# EAGLE design breakout (EAGLE 7.5.0)
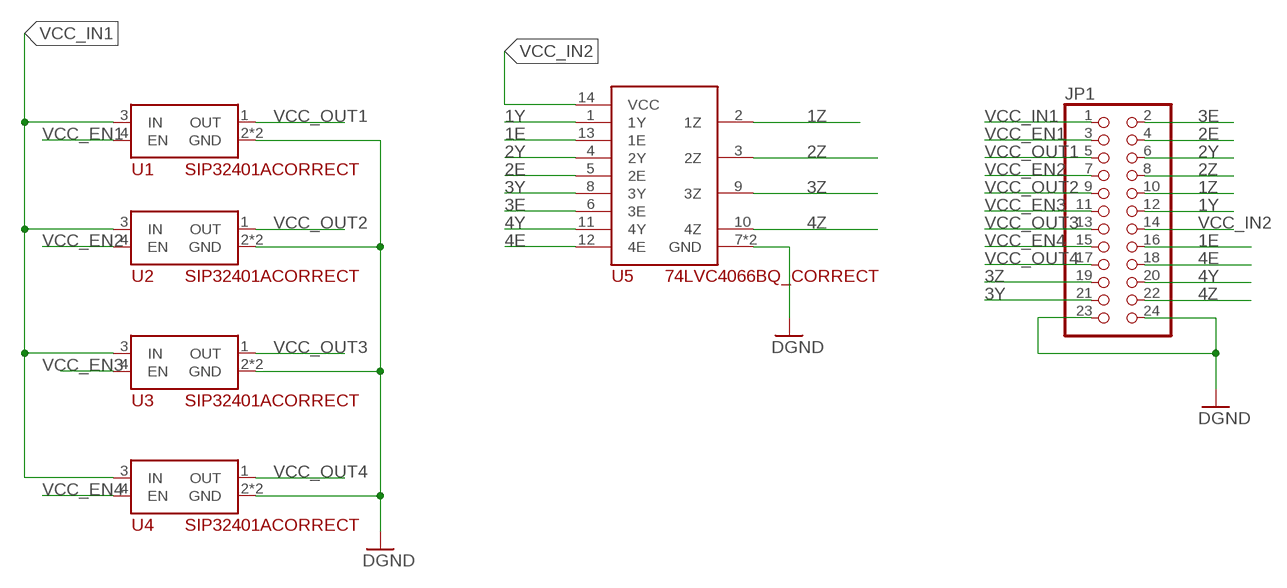
[diagram p0: schematic, sheet 1]

## Parts
JP1  PINHD-2X12/90  [2X12/90]
U1  SIP32401ACORRECT  [TDFN4_CORRECT]
U2  SIP32401ACORRECT  [TDFN4_CORRECT]
U3  SIP32401ACORRECT  [TDFN4_CORRECT]
U4  SIP32401ACORRECT  [TDFN4_CORRECT]
U5  74LVC4066BQ_CORRECT  [DHVQFN14_CORRECTED]

## Nets
1E: JP1.16 U5.13(1E)
1Y: JP1.12 U5.1(1Y)
1Z: JP1.10 U5.2(1Z)
2E: JP1.4 U5.5(2E)
2Y: JP1.6 U5.4(2Y)
2Z: JP1.8 U5.3(2Z)
3E: JP1.2 U5.6(3E)
3Y: JP1.21 U5.8(3Y)
3Z: JP1.19 U5.9(3Z)
4E: JP1.18 U5.12(4E)
4Y: JP1.20 U5.11(4Y)
4Z: JP1.22 U5.10(4Z)
GND: JP1.23 JP1.24 U1.2(GND) U1.PADDLE(GND) U2.2(GND) U2.PADDLE(GND) U3.2(GND) U3.PADDLE(GND) U4.2(GND) U4.PADDLE(GND) U5.7(GND) U5.PADDLE(GND) ; supply symbol labelled DGND
VCC_EN1: JP1.3 U1.4(EN)
VCC_EN2: JP1.7 U2.4(EN)
VCC_EN3: JP1.11 U3.4(EN)
VCC_EN4: JP1.15 U4.4(EN)
VCC_IN1: JP1.1 U1.3(IN) U2.3(IN) U3.3(IN) U4.3(IN)
VCC_IN2: JP1.14 U5.14(VCC)
VCC_OUT1: JP1.5 U1.1(OUT)
VCC_OUT2: JP1.9 U2.1(OUT)
VCC_OUT3: JP1.13 U3.1(OUT)
VCC_OUT4: JP1.17 U4.1(OUT)

## Library data of the parts
JP1 = pinhead:PINHD-2X12: PIN HEADER
U1-U4 = imix:SIP32401A: SIP32401A slew rate controlled load switch from Vishay.
U5 = imix:74LVC4066: 74LVC4066 bidirectional quad analog switch.; DATASHEET: http://www.digikey.com/product-detail/en/nexperia-usa-inc/74LVC4066BQ,115/568-3019-1-ND/1023424; MANUFACTURER: Nexperia USA Inc.; MPN: 74LVC4066BQ; VENDOR: Digikey; VPN: 568-3019-1-ND

## Board
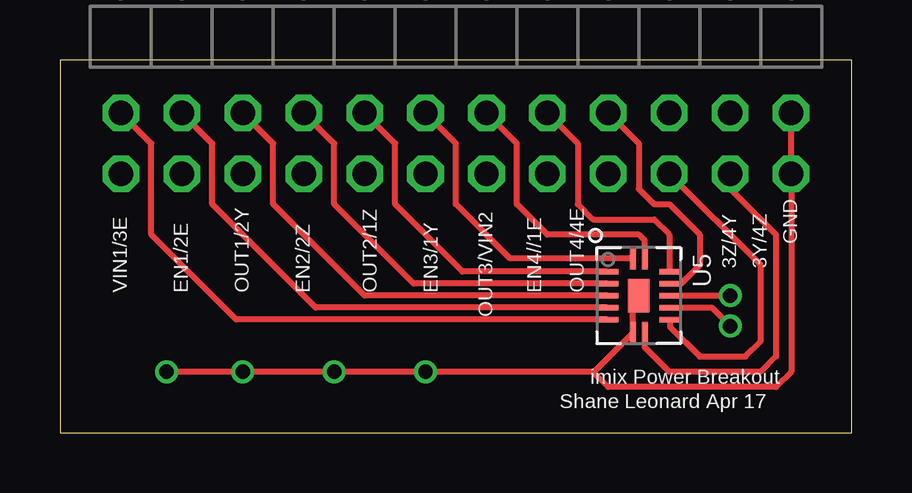
[diagram p1: board, top side]
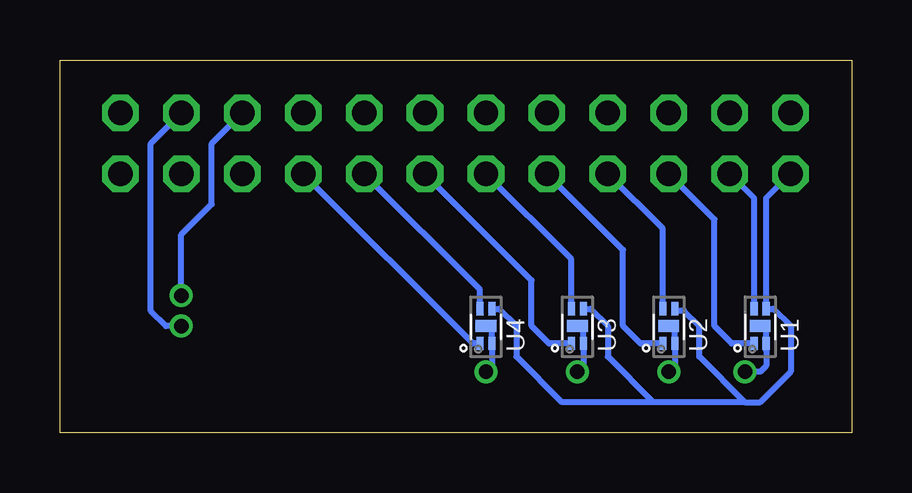
[diagram p2: board, bottom side, seen from below]

Size 33 x 15.54 mm. Coordinates in mm from the lower left corner, seen from the top.
Outline: 0,0 33,0 33,15.54 0,15.54 0,0
Copper layers (1*16): Top 0.0356mm / dielectric 1.5011mm / Bottom 0.0356mm
Design rules "oshpark-2layer": minimum track width 6mil, minimum drill 13mil, track to track 6mil, track to pad 6mil, pad to pad 6mil, via to via 6mil, smd to smd 6mil, copper to edge 15mil, drill to drill 6mil, minimum pad ring 7mil, minimum via ring 7mil, stop-mask expansion 2.5mil, vias tented up to drill 0mil, thermal gap 10mil

### Footprints (pad centres in the part's own frame; a part is rotated, then mirrored left to right if it is on the bottom)
2X12/90 = drill 1.016 octagon: 1 -13.97,-6.35; 2 -13.97,-3.81; 3 -11.43,-6.35; 4 -11.43,-3.81; 5 -8.89,-6.35; 6 -8.89,-3.81; 7 -6.35,-6.35; 8 -6.35,-3.81; 9 -3.81,-6.35; 10 -3.81,-3.81; 11 -1.27,-6.35; 12 -1.27,-3.81; 13 1.27,-6.35; 14 1.27,-3.81; 15 3.81,-6.35; 16 3.81,-3.81; 17 6.35,-6.35; 18 6.35,-3.81; 19 8.89,-6.35; 20 8.89,-3.81; 21 11.43,-6.35; 22 11.43,-3.81; 23 13.97,-6.35; 24 13.97,-3.81
TDFN4_CORRECT = smd 0.3 x 0.55: 1 0.25,0.725; 2 -0.25,0.725; 3 -0.25,-0.725; 4 0.25,-0.725 | smd 0.86 x 0.5: PADDLE 0,0
DHVQFN14_CORRECTED = smd 0.9 x 0.24: 1 -1.55,-0.25; 7 1.55,-0.25; 8 1.55,0.25; 14 -1.55,0.25 | smd 0.24 x 0.9: 2 -1,-1.3; 3 -0.5,-1.3; 4 0,-1.3; 5 0.5,-1.3; 6 1,-1.3; 9 1,1.3; 10 0.5,1.3; 11 0,1.3; 12 -0.5,1.3; 13 -1,1.3 | smd 1.4 x 0.9: PADDLE 0,0

### Placement (x,y rotation side)
JP1  16.51,17.14 0 top
U1  3.81,4.45 180 bottom
U2  7.62,4.45 180 bottom
U3  11.43,4.45 180 bottom
U4  15.24,4.45 180 bottom
U5  24.13,5.71 270 top

### Tracks (layer width: path | path; a pad name or v marks a point on that pad's centre or on a via)
1E
  Top 0.254: JP1.16 21.59,12.06 21.59,9.53 22.23,8.89 24.77,8.89 25.4,8.26 25.4,6.75 U5.13
1Y
  Top 0.254: U5.1 18.77,7.26 16.51,9.53 16.51,12.06 JP1.12
1Z
  Top 0.254: U5.2 16.78,6.71 13.97,9.53 13.97,12.06 JP1.10
2E
  Top 0.254: U5.5 10.66,5.21 6.35,9.53 6.35,12.06 JP1.4
2Y
  Top 0.254: U5.4 12.7,5.71 8.89,9.53 8.89,12.06 JP1.6
2Z
  Top 0.254: U5.3 14.74,6.21 11.43,9.53 11.43,12.06 JP1.8
3E
  Top 0.254: U5.6 7.35,4.71 3.81,8.26 3.81,12.06 JP1.2
3Y
  Top 0.254: JP1.21 27.94,10.16 29.84,8.26 29.84,3.17 29.21,2.54 25.4,2.54 24.38,3.56 U5.8
3Z
  Top 0.254: U5.9 25.43,4.42 26.67,3.17 28.57,3.17 29.21,3.81 29.21,6.99 JP1.19
4E
  Top 0.254: JP1.18 24.13,12.06 24.13,10.16 24.77,9.53 25.4,9.53 26.67,8.26 26.67,6.99 25.9,6.21 U5.12
4Y  (via drill 0.6)
  Top 0.254: U5.11 v27.94,5.71
  Bottom 0.254: v27.94,5.71 27.94,8.26 26.67,9.53 26.67,12.06 JP1.20
4Z  (via drill 0.6)
  Top 0.254: U5.10 27.17,5.21 v27.94,4.45
  Bottom 0.254: v27.94,4.45 28.57,4.45 29.21,5.08 29.21,12.06 JP1.22
GND  (via drill 0.6)
  Top 0.254: 22.23,2.54 22.25,2.54 U5.7 23.88,5.71 U5.PADDLE | 22.23,2.54 v15.24,2.54 v11.43,2.54 v7.62,2.54 v4.45,2.54 | 22.23,2.54 22.86,1.91 29.84,1.91 30.48,2.54 JP1.23 JP1.24
  Bottom 0.254: v7.62,2.54 arc-90 7.37,2.79 U2.2 7.37,4.2 arc-90 U2.PADDLE | v11.43,2.54 arc-90 11.18,2.79 U3.2 11.18,4.2 arc-90 U3.PADDLE | v15.24,2.54 arc-90 14.99,2.79 U4.2 14.99,4.2 arc-90 U4.PADDLE | U1.PADDLE arc90 3.56,4.2 U1.2 3.56,3.42 3.56,2.79 3.81,2.54 v4.45,2.54
VCC_EN1
  Bottom 0.254: U1.4 4.06,9.78 JP1.3
VCC_EN2
  Bottom 0.254: U2.4 7.87,8.51 JP1.7
VCC_EN3
  Bottom 0.254: U3.4 11.68,7.24 JP1.11
VCC_EN4
  Bottom 0.254: U4.4 15.49,5.96 JP1.15
VCC_IN1
  Bottom 0.254: JP1.1 3.56,9.78 U1.3 3.27,5.17 2.54,4.45 2.54,2.54 3.81,1.27 4.45,1.27 | 4.45,1.27 6.35,3.17 6.35,4.45 6.99,5.08 7.28,5.08 U2.3 | U3.3 10.88,5.17 10.16,4.45 10.16,3.17 8.26,1.27 | U4.3 14.7,5.17 13.97,4.45 13.97,3.17 12.06,1.27 8.26,1.27 | 4.45,1.27 8.26,1.27
VCC_IN2
  Top 0.254: U5.14 24.38,8.01 24.13,8.26 20.32,8.26 19.05,9.53 19.05,12.06 JP1.14
VCC_OUT1
  Bottom 0.254: U1.1 4.99,3.72 5.71,4.45 5.71,8.89 JP1.5
VCC_OUT2
  Bottom 0.254: U2.1 8.8,3.72 9.53,4.45 9.53,7.62 JP1.9
VCC_OUT3
  Bottom 0.254: U3.1 12.61,3.72 13.34,4.45 13.34,6.35 JP1.13
VCC_OUT4
  Bottom 0.254: U4.1 15.79,3.72 JP1.17

### Text on the board
tPlace: GND | 3Z/4Y | 3Y/4Z | VIN1/3E | EN1/2E | OUT1/2Y | EN2/2Z | OUT2/1Z | EN3/1Y | EN4//1E | OUT4/4E | OUT3/VIN2 | imix Power Breakout | Shane Leonard Apr 17